# Altium schematic sheet LORA.SchDoc
size A; SheetNumber: 4; SheetTotal: 5
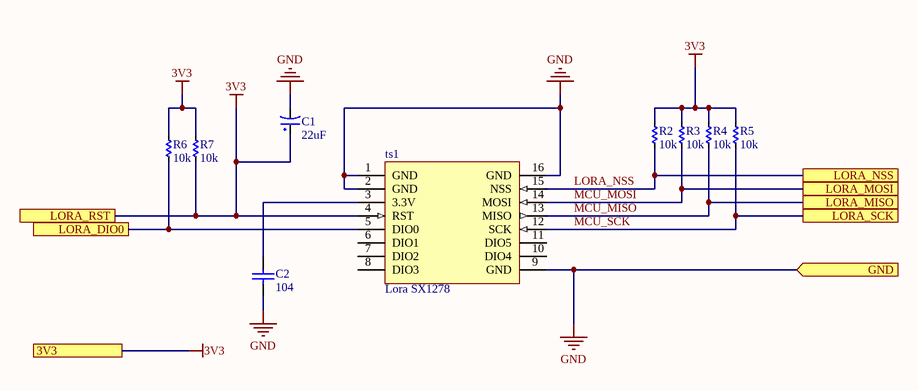
[diagram p0: LORA.SchDoc]

## Parts
C1  22uF  [tu hoa 5mm]
C2  104  [tu 0805]
R2  10k  [RES-SMD-0805]
R3  10k  [RES-SMD-0805]
R4  10k  [RES-SMD-0805]
R5  10k  [RES-SMD-0805]
R6  10k  [RES-SMD-0805]
R7  10k  [RES-SMD-0805]
ts1  Lora SX1278  [*XCVR_RFM69HW-868S2]

## Ports
3V3, GND (in), LORA_DIO0, LORA_MISO, LORA_MOSI, LORA_NSS, LORA_RST, LORA_SCK

## Nets
3V3: C1.1 R2.1 R3.1 R4.1 R5.1 R6.1 R7.1 R7.2 ts1.4(RST) ; port 3V3, port LORA_RST
GND: C1.2 C2.1 ts1.1(GND) ts1.2(GND) ts1.9(GND) ts1.16(GND) ; port GND
LORA_DIO0: R6.2 ts1.5(DIO0) ; port LORA_DIO0
LORA_NSS: R2.2 ts1.15(NSS) ; port LORA_NSS
MCU_MISO: R4.2 ts1.13(MISO) ; port LORA_MISO
MCU_MOSI: R3.2 ts1.14(MOSI) ; port LORA_MOSI
MCU_SCK: R5.2 ts1.12(SCK) ; port LORA_SCK
NetC2_2: C2.2 ts1.3(3.3V)

Not connected (* = marked no-connect by the designer): ts1 6(DIO1) 7(DIO2) 8(DIO3) 10(DIO4) 11(DIO5)

## Library data of the parts
C1 = Tu Hoa 22uF 35V 5x11: Cắm; Don_Vi: Con; So_Chan: 2; Ten_Linh_Kien: Tụ Hóa 22uF 35V 5x11MM; Ma_Hang: MH001350; Chung_Loai: Cắm; Kieu_Chan: *
C2 = Tu 0805 104 50V 10%: Dán; Don_Vi: Con; So_Chan: 2; Ten_Linh_Kien: Tụ 0805 104-100nF 10% 50V; Ma_Hang: MH004551; Chung_Loai: Dán; Kieu_Chan: *
R2-R7 = Res-SMD: Resistor; Manufacturer: Generic Components; Class: Passive; Published: 08/06/2000; Publisher: Altium Hobart Technology Centre